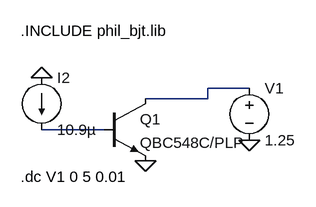
[diagram p0: schematic tbjphillips(ICvsVCE)5mA.asc]
tbjphillips(ICvsVCE)5mA.asc, the LTspice schematic file:
Version 4
SHEET 1 880 680
WIRE 352 112 288 112
WIRE 288 128 288 112
WIRE 288 128 192 128
WIRE 128 176 32 176
FLAG 192 224 0
FLAG 352 192 0
FLAG 32 96 0
SYMBOL npn 128 128 R0
SYMATTR InstName Q1
SYMATTR Value QBC548C/PLP
SYMBOL voltage 352 96 R0
WINDOW 123 0 0 Left 2
WINDOW 39 0 0 Left 2
SYMATTR InstName V1
SYMATTR Value 1.25
SYMBOL current 32 96 R0
WINDOW 123 0 0 Left 2
WINDOW 39 0 0 Left 2
SYMATTR InstName I2
SYMATTR Value 10.9µ
TEXT 0 24 Left 2 !.INCLUDE phil_bjt.lib
TEXT 0 248 Left 2 !.dc V1 0 5 0.01

The netlist it stands for:
* tbjphillips(ICvsVCE)5mA.asc
Q1 N001 N002 0 0 QBC548C/PLP
V1 N001 0 1.25
I2 0 N002 10.9µ
.model NPN NPN
.model PNP PNP
.lib standard.bjt
.INCLUDE phil_bjt.lib
.dc V1 0 5 0.01
.backanno
.end